# Altium schematic sheet Microcontroller block.SchDoc
size A4
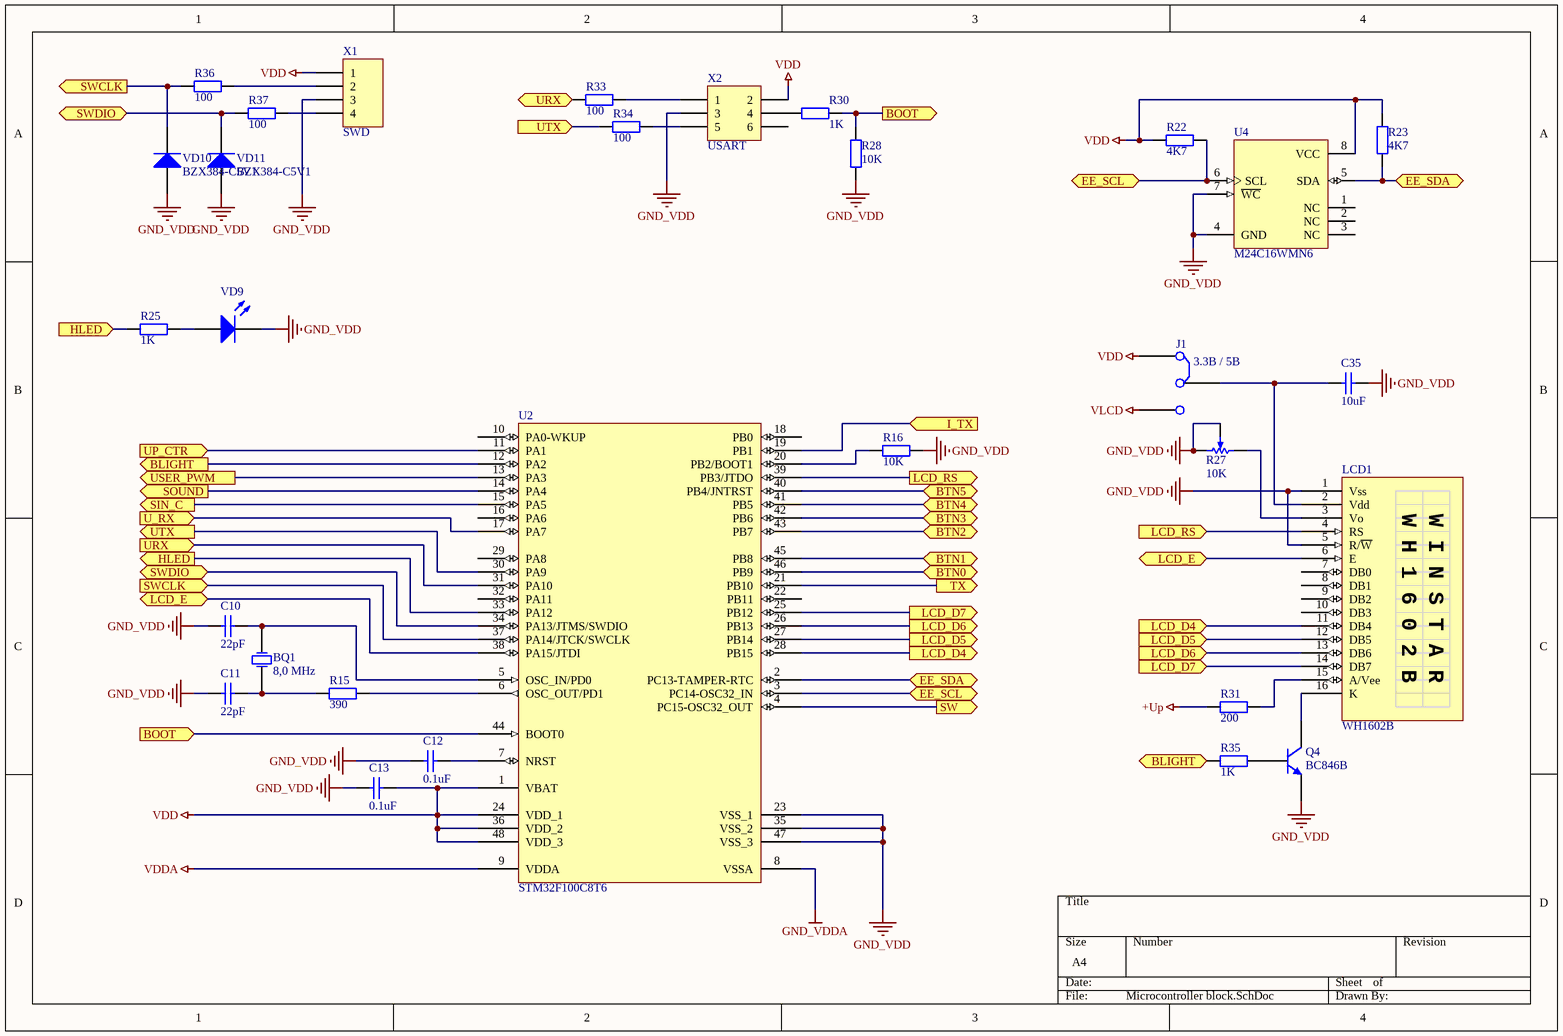
[diagram p0: Microcontroller block.SchDoc]

## Parts
BQ1  8,0 MHz  [HC-49/U3H (low profile)]
C10  22pF  [0805]
C11  22pF  [0805]
C12  0.1uF  [0805]
C13  0.1uF  [1206_SMD_Capacitor]
C35  10uF  [1206_SMD_Capacitor]
J1  3.3В / 5В  [1206_SMD_JUMPER SELECTOR]
LCD1  WH1602B  [WS1602B-3]
Q4  BC846B  [SOT23_N]
R15  390  [1206_SMD_Resistor]
R16  10K  [1206_SMD_Resistor]
R22  4K7  [1206_SMD_Resistor]
R23  4K7  [1206_SMD_Resistor]
R25  1K  [1206_SMD_Resistor]
R27  10K  [3362P]
R28  10K  [1206_SMD_Resistor]
R30  1K  [1206_SMD_Resistor]
R31  200  [1206_SMD_Resistor]
R33  100  [1206_SMD_Resistor]
R34  100  [1206_SMD_Resistor]
R35  1K  [1206_SMD_Resistor]
R36  100  [1206_SMD_Resistor]
R37  100  [1206_SMD_Resistor]
U2  STM32F100C8T6  [LQFP-48_L]
U4  M24C16WMN6  [SO-8]
VD9  LED0  [1206_SMD_Resistor]  (value not drawn)
VD10  BZX384-C5V1  [SOD323]
VD11  BZX384-C5V1  [SOD323]
X1  SWD  [HDR1X4]
X2  USART  [HDR2X3]

## Ports
BLIGHT (in), BLIGHT (out), BOOT (in), BOOT (out), BTN0 (bidir), BTN1 (bidir), BTN2 (bidir), BTN3 (bidir), BTN4 (bidir), BTN5 (bidir), EE_SCL (bidir), EE_SDA (bidir), HLED (in), HLED (out), I_TX (in), LCD_D4 (in), LCD_D4 (out), LCD_D5 (in), LCD_D5 (out), LCD_D6 (in), LCD_D6 (out), LCD_D7 (in), LCD_D7 (out), LCD_E, LCD_E (bidir), LCD_RS (in), LCD_RS (out), SIN_C (out), SOUND (out), SW (out), SWCLK (in), SWCLK (out), SWDIO (bidir), TX (out), U_RX (in), UP_CTR (in), URX (in), URX (out), USER_PWM (out), UTX (in), UTX (out)

## Nets
+Up: R31.1
GND_VDD: C10.1 C11.1 C12.1 C13.1 C35.2 LCD1.1(Vss) LCD1.5(R/~{W}) Q4.2(E) R16.2 R27.1 R27.2 R28.1 U2.23(VSS_1) U2.35(VSS_2) U2.47(VSS_3) U4.4(GND) U4.7(~{WC}) VD9.2(K) VD10.1(A) VD11.1(A) X1.3 X2.3
GND_VDDA: U2.8(VSSA)
VDD: C13.2 J1.1 R22.1 R23.2 U2.1(VBAT) U2.24(VDD_1) U2.36(VDD_2) U2.48(VDD_3) U4.8(VCC) X1.1 X2.2
VDDA: U2.9(VDDA)
VLCD: J1.2
BLIGHT: R35.1 U2.12(PA2) ; port BLIGHT
BOOT: R28.2 R30.2 U2.44(BOOT0) ; port BOOT
BTN0: U2.46(PB9) ; port BTN0
BTN1: U2.45(PB8) ; port BTN1
BTN2: U2.43(PB7) ; port BTN2
BTN3: U2.42(PB6) ; port BTN3
BTN4: U2.41(PB5) ; port BTN4
BTN5: U2.40(PB4/JNTRST) ; port BTN5
EE_SCL: R22.2 U2.3(PC14-OSC32_IN) U4.6(SCL) ; port EE_SCL
EE_SDA: R23.1 U2.2(PC13-TAMPER-RTC) U4.5(SDA) ; port EE_SDA
HLED: R25.2 U2.33(PA12) ; port HLED
I_TX: U2.19(PB1) ; port I_TX
LCD_D4: LCD1.11(DB4) U2.28(PB15) ; port LCD_D4
LCD_D5: LCD1.12(DB5) U2.27(PB14) ; port LCD_D5
LCD_D6: LCD1.13(DB6) U2.26(PB13) ; port LCD_D6
LCD_D7: LCD1.14(DB7) U2.25(PB12) ; port LCD_D7
LCD_E: LCD1.6(E) U2.38(PA15/JTDI) ; port LCD_E
LCD_RS: LCD1.4(RS) U2.39(PB3/JTDO) ; port LCD_RS
SIN_C: U2.15(PA5) ; port SIN_C
SOUND: U2.14(PA4) ; port SOUND
SW: U2.4(PC15-OSC32_OUT) ; port SW
SWCLK: R36.1 U2.37(PA14/JTCK/SWCLK) VD10.3(K) ; port SWCLK
SWDIO: R37.1 U2.34(PA13/JTMS/SWDIO) VD11.3(K) ; port SWDIO
TX: U2.21(PB10) ; port TX
U_RX: U2.17(PA7) ; port U_RX
UP_CTR: U2.11(PA1) ; port UP_CTR
URX: R33.1 U2.31(PA10) ; port URX
USER_PWM: U2.13(PA3) ; port USER_PWM
UTX: R34.1 U2.30(PA9) ; port UTX
NetBQ1_1: BQ1.1(OSC1) C11.2 R15.1
NetBQ1_2: BQ1.2(OSC2) C10.2 U2.5(OSC_IN/PD0)
NetC12_2: C12.2 U2.7(NRST)
NetC35_1: C35.1 J1.0 LCD1.2(Vdd)
NetLCD1_3: LCD1.3(Vo) R27.3
NetLCD1_15: LCD1.15(A/Vee) R31.2
NetLCD1_16: LCD1.16(K) Q4.3(C)
NetQ4_1: Q4.1(B) R35.2
NetR15_2: R15.2 U2.6(OSC_OUT/PD1)
NetR16_1: R16.1 U2.20(PB2/BOOT1)
NetR25_1: R25.1 VD9.1(A)
NetR30_1: R30.1 X2.4
NetR33_2: R33.2 X2.1
NetR34_2: R34.2 X2.5
NetR36_2: R36.2 X1.2
NetR37_2: R37.2 X1.4

Not connected (* = marked no-connect by the designer): LCD1 7(DB0) 8(DB1) 9(DB2) 10(DB3); U2 10(PA0-WKUP) 16(PA6) 18(PB0) 22(PB11) 29(PA8) 32(PA11); U4 1(NC) 2(NC) 3(NC); X2 6

## Notes on the sheet
- (in symbol WH1602B) W H 1 6 0 2 B; W I N S T A R

## Library data of the parts
BQ1 = XTAL: Crystal Oscillator; Published: 8-Jun-2000; LatestRevisionDate: 17-Jul-2002; LatestRevisionNote: Re-released for DXP Platform.; PackageReference: R38; Publisher: Altium Limited; PackageDescription: Crystal, Thru-Hole; 2 Leads; Body 3.1 x 8.2 mm (Dia.xH); Frequence: 8,0 MHz
C10-C13 C35 = Capacitor SMD: Capacitor; Published: 8-Jun-2000; LatestRevisionDate: 17-Jul-2002; LatestRevisionNote: Re-released for DXP Platform.; PackageReference: RAD-0.3; Publisher: Altium Limited
  C10 C11: Value: 22pF
  C12 C13: Value: 0.1uF
  C35: Value: 10uF
J1 = Jump Selector
LCD1 = WH1602B: Символьный ЖКИ разрешением 16 символов на 2 строки
Q4 = BC846B: NPN General-purpose Transistor; Published: 17-Sep-2003; LatestRevisionDate: 12-Dec-2006; LatestRevisionNote: IPC-7351 Footprint Added.; DatasheetVersion: 4-Feb-2002; PackageVersion: May-1999; PackageReference: SOT23; Publisher: Altium Limited; PackageDescription: 3-Pin SOT-23 Package 0.95 mm Pitch, 2.3 mm Lead Span; ComponentLink1Description: Manufacturer Link; ComponentLink1URL: http://www.semiconductors.philips.com/; ComponentLink2Description: Datasheet; ComponentLink2URL: http://www.semiconductors.philips.com/acrobat/datasheets/BC846_BC847_BC848_5.pdf
R15 R16 R22 R23 R25 R28 R30 R31 R33-R37 = Resistor: Published: 8-Jun-2000; LatestRevisionDate: 17-Jul-2002; LatestRevisionNote: Re-released for DXP Platform.; PackageReference: AXIAL-0.4; Publisher: Altium Limited; PackageDescription: Axial Device, Thru-Hole; 2 Leads; 0.4 in Pin Spacing
  R15: Value: 390
  R16 R28: Value: 10K
  R22 R23: Value: 4K7
  R25 R30 R35: Value: 1K
  R31: Value: 200
  R33 R34 R36 R37: Value: 100
R27 = Trimming Potentiometer: Square Trimming Potentiometer; Published: 17-Dec-2003; DatasheetVersion: Oct-2003; PackageReference: POT4MM-2; Publisher: Altium Limited; PackageDescription: Square Trimming Potentiometer; ComponentLink1Description: Manufacturer Link; ComponentLink1URL: http://bourns.com/2/search.html; Value: 10K
U2 = STM32F101C8T6: STM32 ARM-based 32-bit MCU with 64 Kbytes Flash, 48-pin LQFP, Industrial Temperature; Published: 30-May-2008; DatasheetVersion: rev6, Mar-2008; PackageVersion: Mar-2008; PackageReference: LQFP48; Publisher: Altium Limited; PackageDescription: 48-Pin Low-Profile Quad Flat Pack, 7 x 7 mm Body, 0.5 mm Pitch (LQFP48); ComponentLink1Description: Manufacturer Link; ComponentLink1URL: www.st.com/stm32; ComponentLink2Description: Datasheet; ComponentLink2URL: http://www.st.com/stonline/products/literature/ds/13586.pdf
U4 = M24C16WMN6: 16Kbit Serial IІC Bus EEPROM; Published: 24-Aug-2001; LatestRevisionDate: 13-Apr-2006; LatestRevisionNote: IPC-7351 Footprint Added.; DatasheetVersion: Sep-1999; PackageVersion: Jul-1999; PackageReference: SOP8; Publisher: Altium Limited; PackageDescription: 8-Pin Small Outline Integrated Circuit 1.27 mm Pitch; ComponentLink1Description: Manufacturer Link; ComponentLink1URL: http://www.st.com/; ComponentLink2Description: Datasheet; ComponentLink2URL: http://www.st.com/stonline/products/literature/ds/5067/m24c01-r.pdf
VD9 = LED0: Typical INFRARED GaAs LED; Published: 8-Jun-2000; LatestRevisionDate: 08-Jul-2005; LatestRevisionNote: Mech Layer 1 removed.; PackageReference: LED-0; Publisher: Altium Limited; PackageDescription: LED; 2 Leads
VD10 VD11 = BZX84-C5V1: Voltage Regulator Diode; pin to pad: 3>2; Note: Pin 2 is not connected and not drawn; Published: 17-Sep-2003; LatestRevisionDate: 12-Dec-2006; LatestRevisionNote: IPC-7351 Footprint Added.; DatasheetVersion: 18-May-1999; PackageVersion: May-1999; PackageReference: SOT23; Publisher: Altium Limited; PackageDescription: 3-Pin SOT-23 Package 0.95 mm Pitch, 2.3 mm Lead Span; ComponentLink1Description: Manufacturer Link; ComponentLink1URL: http://www.semiconductors.philips.com/; ComponentLink2Description: Datasheet; ComponentLink2URL: http://www.semiconductors.philips.com/acrobat/datasheets/BZX84_SERIES_3.pdf
X1 = Header 4: Header, 4-Pin; LatestRevisionDate: 17-Jul-2002; LatestRevisionNote: Re-released for DXP Platform.; Publisher: Altium Limited
X2 = Header 3X2: Header, 3-Pin, Dual row; LatestRevisionDate: 17-Jul-2002; LatestRevisionNote: Re-released for DXP Platform.; Publisher: Altium Limited